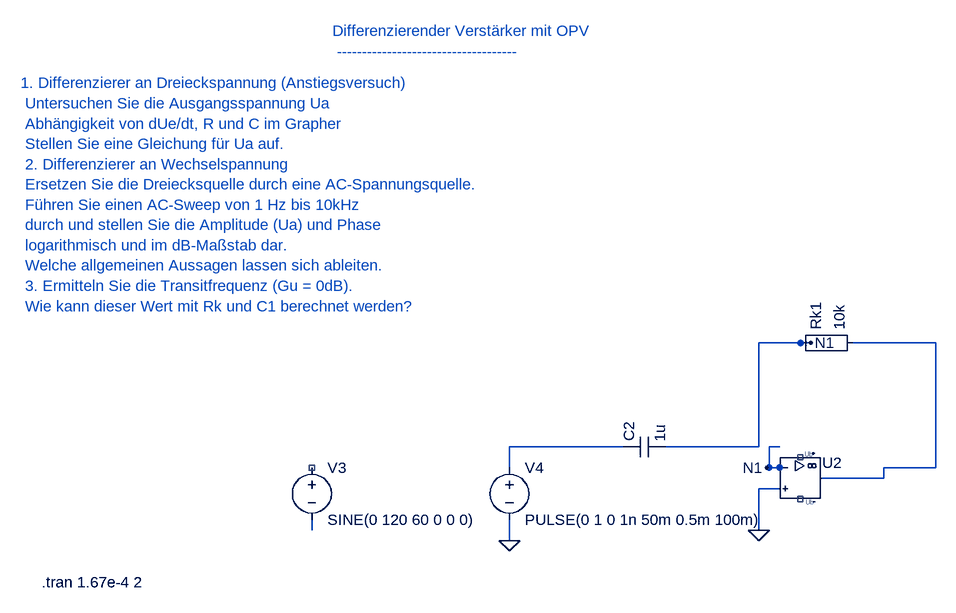
[diagram p0: schematic 7_3_1_Differenzierender_OPV.asc]
7_3_1_Differenzierender_OPV.asc, the LTspice schematic file:
Version 4
SHEET 1 880 680
WIRE 1024 720 1040 720
WIRE 1200 752 1184 752
WIRE 1184 752 1184 720
WIRE 1184 720 1200 720
WIRE 1264 768 1360 768
WIRE 1360 768 1360 752
WIRE 480 832 480 848
WIRE 784 832 784 848
WIRE 1200 784 1168 784
WIRE 1168 784 1168 848
WIRE 1232 560 1168 560
WIRE 1168 560 1168 720
WIRE 1312 560 1440 560
WIRE 1440 560 1440 752
WIRE 1440 752 1360 752
WIRE 1040 720 1168 720
WIRE 784 848 784 864
WIRE 784 752 784 720
WIRE 784 720 960 720
WIRE 1232 560 1248 560
WIRE 1200 752 1180 752
FLAG 1168 848 0
FLAG 784 864 0
FLAG 1168 848 0
FLAG 784 864 0
FLAG 1248 560 N1
FLAG 1180 752 N1
SYMBOL Misc\EuropeanResistor 1216 576 R270
SYMATTR InstName Rk1
SYMATTR Value 10k
SYMBOL cap 960 736 R270
SYMATTR InstName C2
SYMATTR Value 1u
SYMBOL UniversalOpAmp2 1232 768 R0
SYMATTR InstName U2
SYMATTR Value UniversalOpAmp2
SYMBOL voltage 480 736 R0
SYMATTR InstName V3
SYMATTR Value SINE(0 120 60 0 0 0)
SYMBOL voltage 784 736 R0
SYMATTR InstName V4
SYMATTR Value PULSE(0 1 0 1n 50m 0.5m 100m)
TEXT 64 928 Left 2 !.tran 1.67e-4 2
TEXT 512 80 Left 2 ;Differenzierender Verstärker mit OPV \n ------------------------------------
TEXT 32 160 Left 2 ;1. Differenzierer an Dreieckspannung (Anstiegsversuch) \n Untersuchen Sie die Ausgangsspannung Ua \n Abhängigkeit von dUe/dt, R und C im Grapher \n Stellen Sie eine Gleichung für Ua auf. \n 2. Differenzierer an Wechselspannung \n Ersetzen Sie die Dreiecksquelle durch eine AC-Spannungsquelle. \n Führen Sie einen AC-Sweep von 1 Hz bis 10kHz \n durch und stellen Sie die Amplitude (Ua) und Phase \n logarithmisch und im dB-Maßstab dar. \n Welche allgemeinen Aussagen lassen sich ableiten. \n 3. Ermitteln Sie die Transitfrequenz (Gu = 0dB). \n Wie kann dieser Wert mit Rk und C1 berechnet werden?

The netlist it stands for:
* 7_3_1_Differenzierender_OPV.asc
Rk1 N1 N001 10k
C2 N003 N1 1u
XU2 0 N1 NC_01 NC_02 N001 level2 UniversalOpAmp2 Avol=1Meg GBW=10Meg Slew=10Meg Ilimit=25m Rail=0 Vos=0 En=0 Enk=0 In=0 Ink=0 Rin=500Meg  ; pins In+ In- V+ V- OUT
V3 NC_03 N002 SINE(0 120 60 0 0 0)
V4 N003 0 PULSE(0 1 0 1n 50m 0.5m 100m)
.tran 1.67e-4 2
* Differenzierender Verstärker mit OPV
*  ------------------------------------
* 1. Differenzierer an Dreieckspannung (Anstiegsversuch)
*  Untersuchen Sie die Ausgangsspannung Ua
*  Abhängigkeit von dUe/dt, R und C im Grapher
*  Stellen Sie eine Gleichung für Ua auf.
*  2. Differenzierer an Wechselspannung
*  Ersetzen Sie die Dreiecksquelle durch eine AC-Spannungsquelle.
*  Führen Sie einen AC-Sweep von 1 Hz bis 10kHz
*  durch und stellen Sie die Amplitude (Ua) und Phase
*  logarithmisch und im dB-Maßstab dar.
*  Welche allgemeinen Aussagen lassen sich ableiten.
*  3. Ermitteln Sie die Transitfrequenz (Gu = 0dB).
*  Wie kann dieser Wert mit Rk und C1 berechnet werden?
.lib UniversalOpAmp2.lib
.backanno
.end